# Altium project usbTottl_V03.PrjPcb
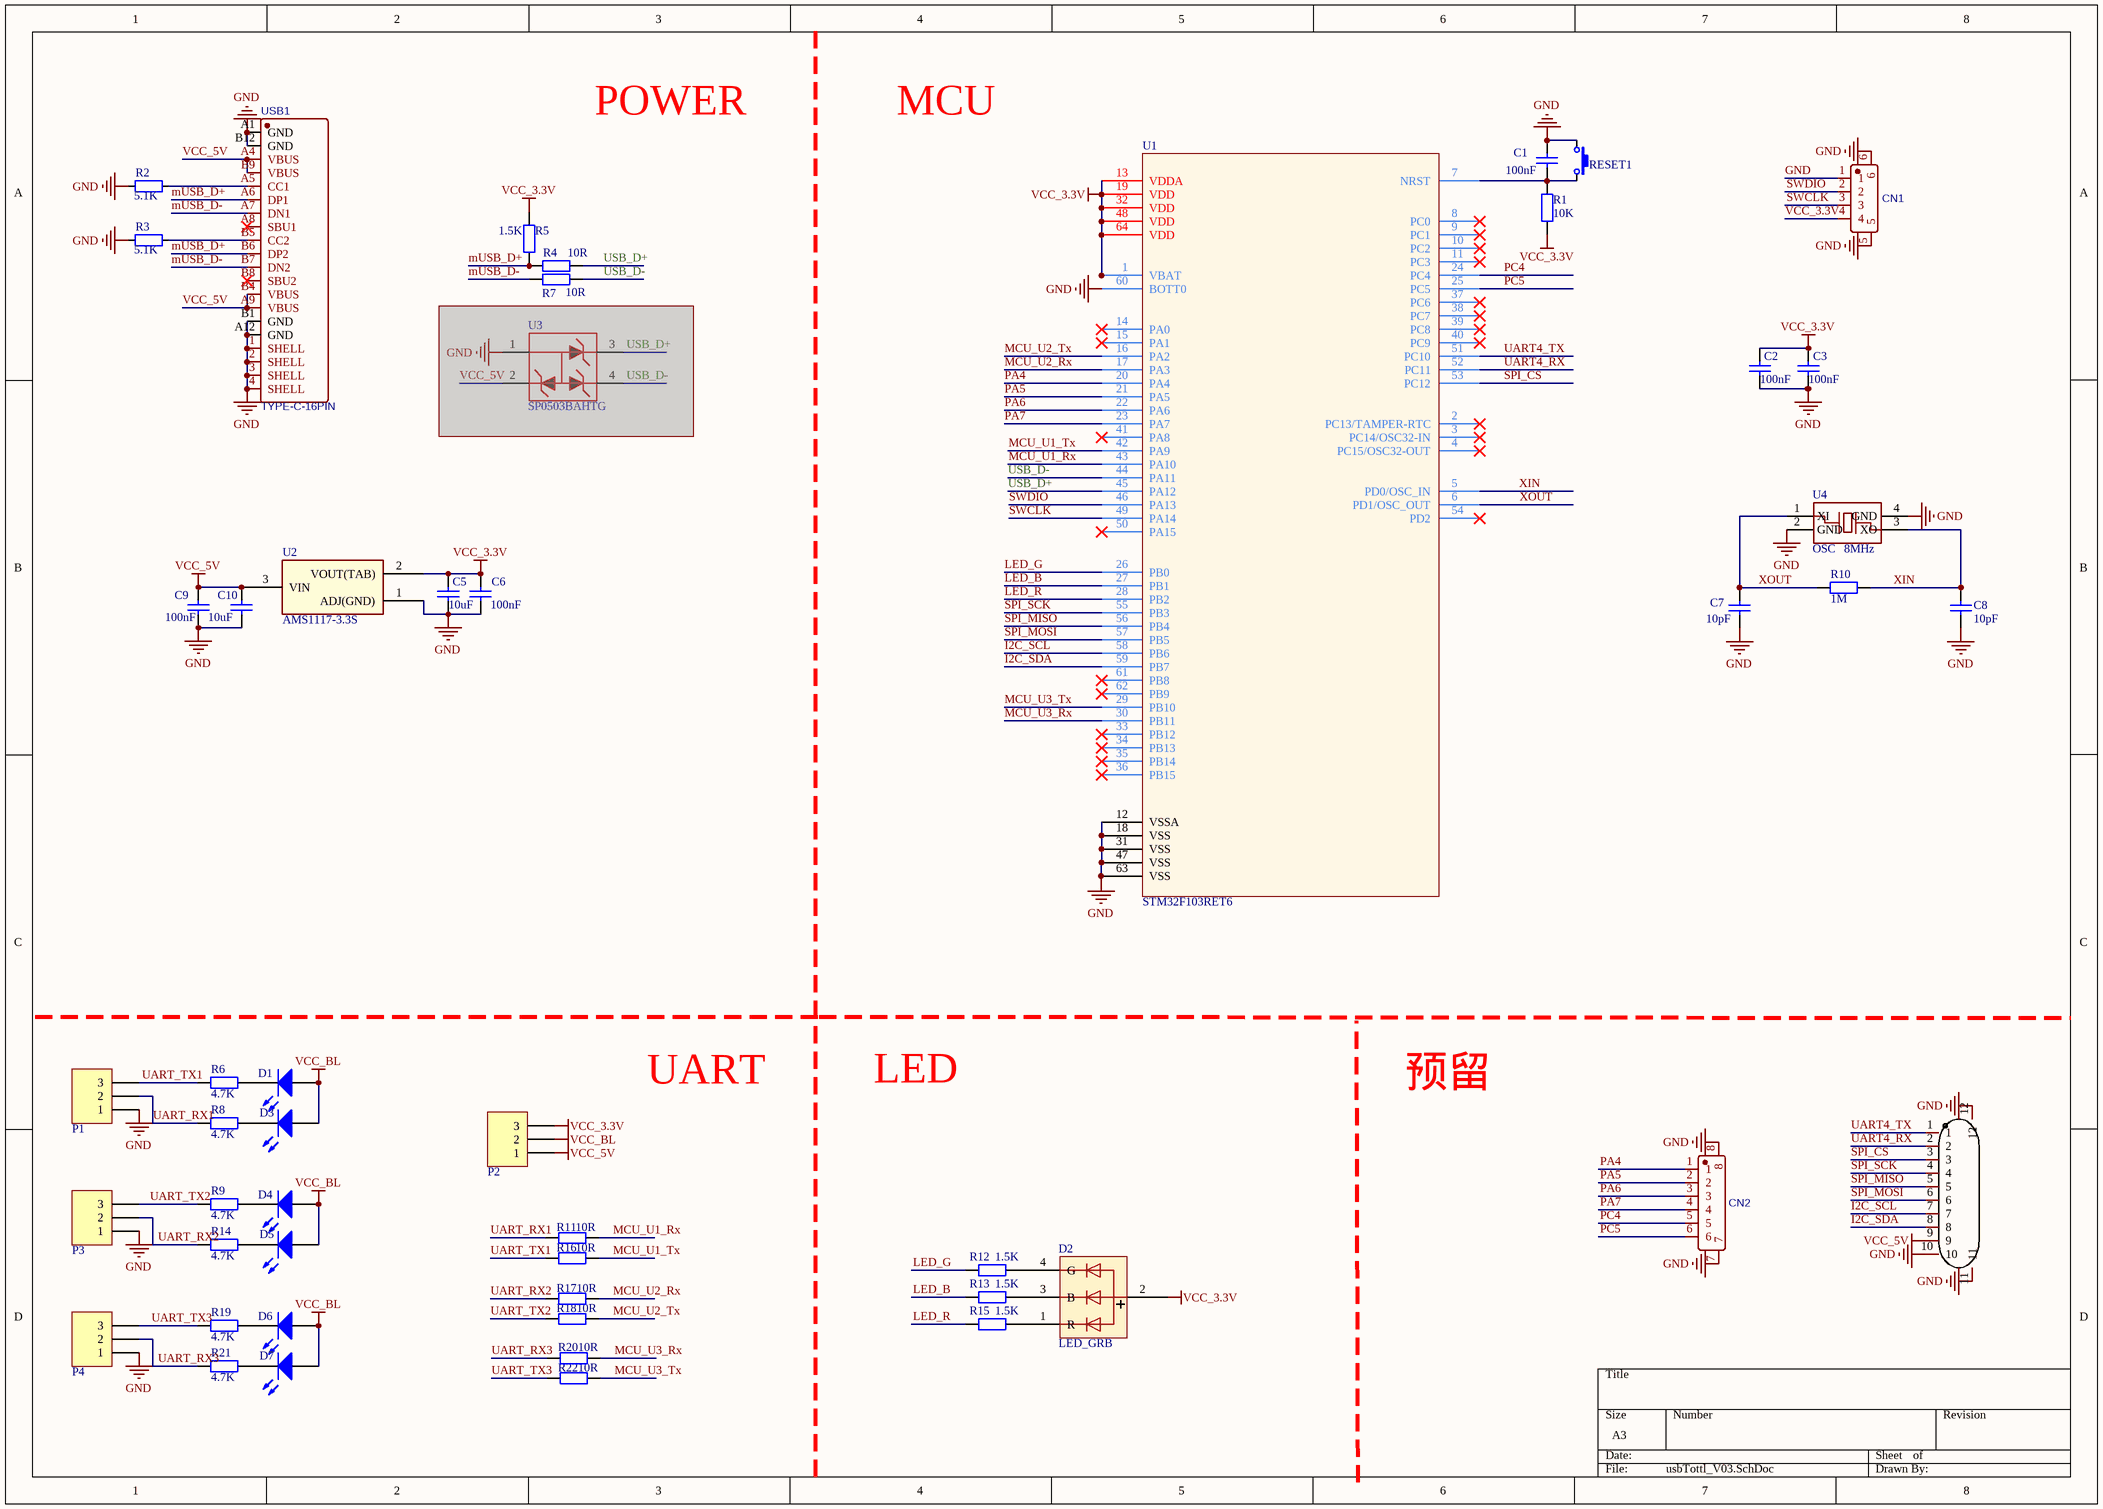
[diagram p0: usbTottl_V03.SchDoc]
1 sheet, 51 parts. Net scope: global (net labels, ports and power ports of the same name join across sheets).
Board file: usbTottl_V03.PcbDoc

## Sheet usbTottl_V03.SchDoc
size A3; SheetNumber: 1; SheetTotal: 1

### Parts
C1  value 100nF  [0603_C]  (hidden comment: Cap)
C2  value 100nF  [0603_C]  (hidden comment: Cap)
C3  value 100nF  [0603_C]  (hidden comment: Cap)
C5  value 10uF  [0603_C]  (hidden comment: Cap)
C6  value 100nF  [0805_C]  (hidden comment: Cap)
C7  value 10pF  [0603_C]  (hidden comment: Cap)
C8  value 10pF  [0603_C]  (hidden comment: Cap)
C9  value 100nF  [0805_C]  (hidden comment: Cap)
C10  value 10uF  [0603_C]  (hidden comment: Cap)
CN1  HDGC1002WR-S-4P  [SH1.0_4P]  (value not drawn)
CN2  WAFER-SH1.0-6PWB  [SH1.0_6P]  (value not drawn)
D1  LED0  [led-0603]  (value not drawn)
D2  LED_GRB  [LED_RGB]
D3  LED0  [led-0603]  (value not drawn)
D4  LED0  [led-0603]  (value not drawn)
D5  LED0  [led-0603]  (value not drawn)
D6  LED0  [led-0603]  (value not drawn)
D7  LED0  [led-0603]  (value not drawn)
P1  Header 3  [HDR3X1_2.54]  (value not drawn)
P2  Header 3  [HDR3X1_2.54]  (value not drawn)
P3  Header 3  [HDR3X1_2.54]  (value not drawn)
P4  Header 3  [HDR3X1_2.54]  (value not drawn)
R1  value 10K  [0603_R]  (hidden comment: Res1)
R2  5.1K  [0603_R]
R3  5.1K  [0603_R]
R4  value 10R  [0603_R]
R5  value 1.5K  [0603_R]
R6  value 4.7K  [0603_R]
R7  value 10R  [0603_R]
R8  value 4.7K  [0603_R]
R9  value 4.7K  [0603_R]
R10  value 1M  [0603_R]  (hidden comment: Res1)
R11  value 10R  [0402_R - M]
R12  value 1.5K  [0402_R - M]  (hidden comment: Res1)
R13  value 1.5K  [0402_R - M]  (hidden comment: Res1)
R14  value 4.7K  [0603_R]
R15  value 1.5K  [0402_R - M]  (hidden comment: Res1)
R16  value 10R  [0402_R - M]
R17  value 10R  [0402_R - M]
R18  value 10R  [0402_R - M]
R19  value 4.7K  [0603_R]
R20  value 10R  [0402_R - M]
R21  value 4.7K  [0603_R]
R22  value 10R  [0402_R - M]
RESET1  TACT 2P  [SW-SMD_2*4]  (value not drawn)
U1  STM32F103RET6  [LQFP-64]
U2  AMS1117-3.3S  [SOT-89]
U3  SP0503BAHTG  [SOT_143]  (masked out: inside a compile mask, not in the netlist)
U4  OSC  [SMD_3225_4P]
U5  WAFER-SH1.0-10PWB  [SH1.0_10P]  (value not drawn)
USB1  TYPE-C-16PIN  [Type-C-16Pin]

### Nets
GND: C1.1 C2.2 C3.2 C5.2 C6.2 C7.1 C8.1 C9.2 C10.2 CN1.1 CN1.5 CN1.6 CN2.7 CN2.8 P1.1 P3.1 P4.1 R2.2 R3.2 RESET1.1 U1.12(VSSA) U1.18(VSS) U1.31(VSS) U1.47(VSS) U1.60(BOTT0) U1.63(VSS) U2.1(ADJ(GND)) U4.2(GND) U4.4(GND) U5.10 U5.11 U5.12 USB1.1(SHELL) USB1.2(SHELL) USB1.3(SHELL) USB1.4(SHELL) USB1.A1(GND) USB1.A12(GND) USB1.B1(GND) USB1.B12(GND)
VCC_3.3V: C2.1 C3.1 C5.1 C6.1 CN1.4 D2.2 P2.3 R1.1 R5.1 U1.1(VBAT) U1.13(VDDA) U1.19(VDD) U1.32(VDD) U1.48(VDD) U1.64(VDD) U2.2(VOUT(TAB))
VCC_5V: C9.1 C10.1 P2.1 U2.3(VIN) U5.9 USB1.A4(VBUS) USB1.A9(VBUS) USB1.B4(VBUS) USB1.B9(VBUS)
VCC_BL: D1.1(A) D3.1(A) D4.1(A) D5.1(A) D6.1(A) D7.1(A) P2.2
I2C_SCL: U1.58(PB6) U5.7
I2C_SDA: U1.59(PB7) U5.8
LED_B: R13.1 U1.27(PB1)
LED_G: R12.1 U1.26(PB0)
LED_R: R15.1 U1.28(PB2)
MCU_U1_Rx: R11.1 U1.43(PA10)
MCU_U1_Tx: R16.1 U1.42(PA9)
MCU_U2_Rx: R17.1 U1.17(PA3)
MCU_U2_Tx: R18.1 U1.16(PA2)
MCU_U3_Rx: R20.1 U1.30(PB11)
MCU_U3_Tx: R22.1 U1.29(PB10)
mUSB_D+: R4.1 R5.2 USB1.A6(DP1) USB1.B6(DP2)
mUSB_D-: R7.2 USB1.A7(DN1) USB1.B7(DN2)
PA4: CN2.1 U1.20(PA4)
PA5: CN2.2 U1.21(PA5)
PA6: CN2.3 U1.22(PA6)
PA7: CN2.4 U1.23(PA7)
PC4: CN2.5 U1.24(PC4)
PC5: CN2.6 U1.25(PC5)
SPI_CS: U1.53(PC12) U5.3
SPI_MISO: U1.56(PB4) U5.5
SPI_MOSI: U1.57(PB5) U5.6
SPI_SCK: U1.55(PB3) U5.4
SWCLK: CN1.3 U1.49(PA14)
SWDIO: CN1.2 U1.46(PA13)
UART4_RX: U1.52(PC11) U5.2
UART4_TX: U1.51(PC10) U5.1
UART_RX1: P1.2 R8.2 R11.2
UART_RX2: P3.2 R14.2 R17.2
UART_RX3: P4.2 R20.2 R21.2
UART_TX1: P1.3 R6.2 R16.2
UART_TX2: P3.3 R9.2 R18.2
UART_TX3: P4.3 R19.2 R22.2
USB_D+: R4.2 U1.45(PA12)
USB_D-: R7.1 U1.44(PA11)
XIN: C8.2 R10.2 U1.5(PD0/OSC_IN) U4.3(XO)
XOUT: C7.2 R10.1 U1.6(PD1/OSC_OUT) U4.1(XI)
NetC1_2: C1.2 R1.2 RESET1.2 U1.7(NRST)
NetD1_2: D1.2(K) R6.1
NetD2_1: D2.1(R) R15.2
NetD2_3: D2.3(B) R13.2
NetD2_4: D2.4(G) R12.2
NetD3_2: D3.2(K) R8.1
NetD4_2: D4.2(K) R9.1
NetD5_2: D5.2(K) R14.1
NetD6_2: D6.2(K) R19.1
NetD7_2: D7.2(K) R21.1
NetR2_1: R2.1 USB1.A5(CC1)
NetR3_1: R3.1 USB1.B5(CC2)

Not connected (* = marked no-connect by the designer): U1 2(PC13/TAMPER-RTC)* 3(PC14/OSC32-IN)* 4(PC15/OSC32-OUT)* 8(PC0)* 9(PC1)* 10(PC2)* 11(PC3)* 14(PA0)* 15(PA1)* 33(PB12)* 34(PB13)* 35(PB14)* 36(PB15)* 37(PC6)* 38(PC7)* 39(PC8)* 40(PC9)* 41(PA8)* 50(PA15)* 54(PD2)* 61(PB8)* 62(PB9)*; USB1 A8(SBU1)* B8(SBU2)*

### Notes on the sheet
- POWER
- MCU
- (near U4) 8MHz
- UART
- LED
- 预留

### Library data of the parts
C1 C7 C8 = Cap: Capacitor; Published: 8-Jun-2000; LatestRevisionDate: 17-Jul-2002; LatestRevisionNote: Re-released for DXP Platform.; PackageReference: RAD-0.3; Publisher: Altium Limited; PackageDescription: Radial Cap, Thru-Hole; 2 Leads; 0.3 in Pin Spacing
C2 C3 C5 C6 C9 C10 = Cap: 无极性电容; Published: 8-Jun-2000; LatestRevisionDate: 17-Jul-2002; LatestRevisionNote: Re-released for DXP Platform.; PackageReference: RAD-0.3; Publisher: Altium Limited
CN1 = HDGC1002WR-S-4P: BOM_Manufacturer: HDGC(华德共创); Contributor: LCSC; BOM_Supplier: LCSC; BOM_Supplier Part: C2936214; BOM_Manufacturer Part: HDGC1002WR-S-4P; BOM_JLCPCB Part Class: Extended Part; spicePre: C; spiceSymbolName: HDGC1002WR-S-4P
CN2 = WAFER-SH1.0-6PWB: BOM_Manufacturer: XUNPU(讯普); Contributor: lcsc; BOM_Supplier: LCSC; BOM_Supplier Part: C3029345; BOM_Manufacturer Part: WAFER-SH1.0-6PWB; link: https://atta.szlcsc.com/upload/public/pdf/source/20220527/1879B8210BD3B2006BCEAC1A40D397B6.pdf; BOM_JLCPCB Part Class: Extended Part; spicePre: C; spiceSymbolName: WAFER-SH1.0-6PWB
D1 D3-D7 = LED0: 发光二极管; Published: 8-Jun-2000; LatestRevisionDate: 08-Jul-2005; LatestRevisionNote: Mech Layer 1 removed.; PackageReference: LED-0; Publisher: Altium Limited
D2 = LED_RGB: 共阳三色LED
P1-P4 = Header 3: 接插件; LatestRevisionDate: 17-Jul-2002; LatestRevisionNote: Re-released for DXP Platform.; Publisher: Altium Limited
R1 R10 = Res1: 贴片电阻; Published: 8-Jun-2000; LatestRevisionDate: 17-Jul-2002; LatestRevisionNote: Re-released for DXP Platform.; PackageReference: AXIAL-0.4; Publisher: Altium Limited
R2 R3 = 电阻-0402: Resistor; Value: 22R
R4-R9 R11 R14 R16-R22 = Res2: Resistor; Published: 8-Jun-2000; LatestRevisionDate: 17-Jul-2002; LatestRevisionNote: Re-released for DXP Platform.; PackageReference: AXIAL-0.4; Publisher: Altium Limited
R12 R13 R15 = Res: 贴片电阻; Published: 8-Jun-2000; LatestRevisionDate: 17-Jul-2002; LatestRevisionNote: Re-released for DXP Platform.; PackageReference: AXIAL-0.4; Publisher: Altium Limited
RESET1 = ButtonTACT_3x4x2_180: Button; value: 3x4; type: TACT 2P
U1 = STM32F103RET6: STM32F103RET6单片机64引脚
U2 = AMS1117-3.3S: SOT-89
U3 = SP0503BAHTG: 3-channels ESD protection
U4 = SMD-2520: 四脚无源晶振
U5 = WAFER-SH1.0-10PWB: Manufacturer: XUNPU(讯普); Add into BOM: yes; Pitch: 1mm; Pins Structure: 1x10P; Number of PINs Per Row: 10; Gender: 公型插针; Current Rating (Max): 1A; Name: WAFER-SH1.0-10PWB; Symbol: WAFER-SH1.0-10PWB; Device: WAFER-SH1.0-10PWB; LCSC Part Name: 1mm 1x10P 卧贴; Supplier Part: C3029349; Manufacturer Part: WAFER-SH1.0-10PWB; Supplier Footprint: SMD,P=1mm; JLCPCB Part Class: Extended Part; Datasheet: https://atta.szlcsc.com/upload/public/pdf/source/20220527/1879B8210BD3B2006BCEAC1A40D397B6.pdf; Supplier: LCSC; Convert to PCB: yes; Number of Rows: 1; Mounting Style: 卧贴; Operating Temperature Range: -25℃~+85℃
USB1 = TYPE-C16PIN: BOM_Manufacturer: SHOU HAN; Contributor: LCSC; BOM_Supplier: LCSC; BOM_Supplier Part: C393939; BOM_Manufacturer Part: TYPE-C16PIN; spicePre: U; spiceSymbolName: TYPE-C16PIN